# Altium schematic sheet Sheet1.SchDoc
size 431 x 279 mm; SheetNumber: 1; SheetTotal: 1; ENG_APP_DATE: --/--/--; DSN_APP_DATE: --/--/--; CHK_APP_DATE: --/--/--
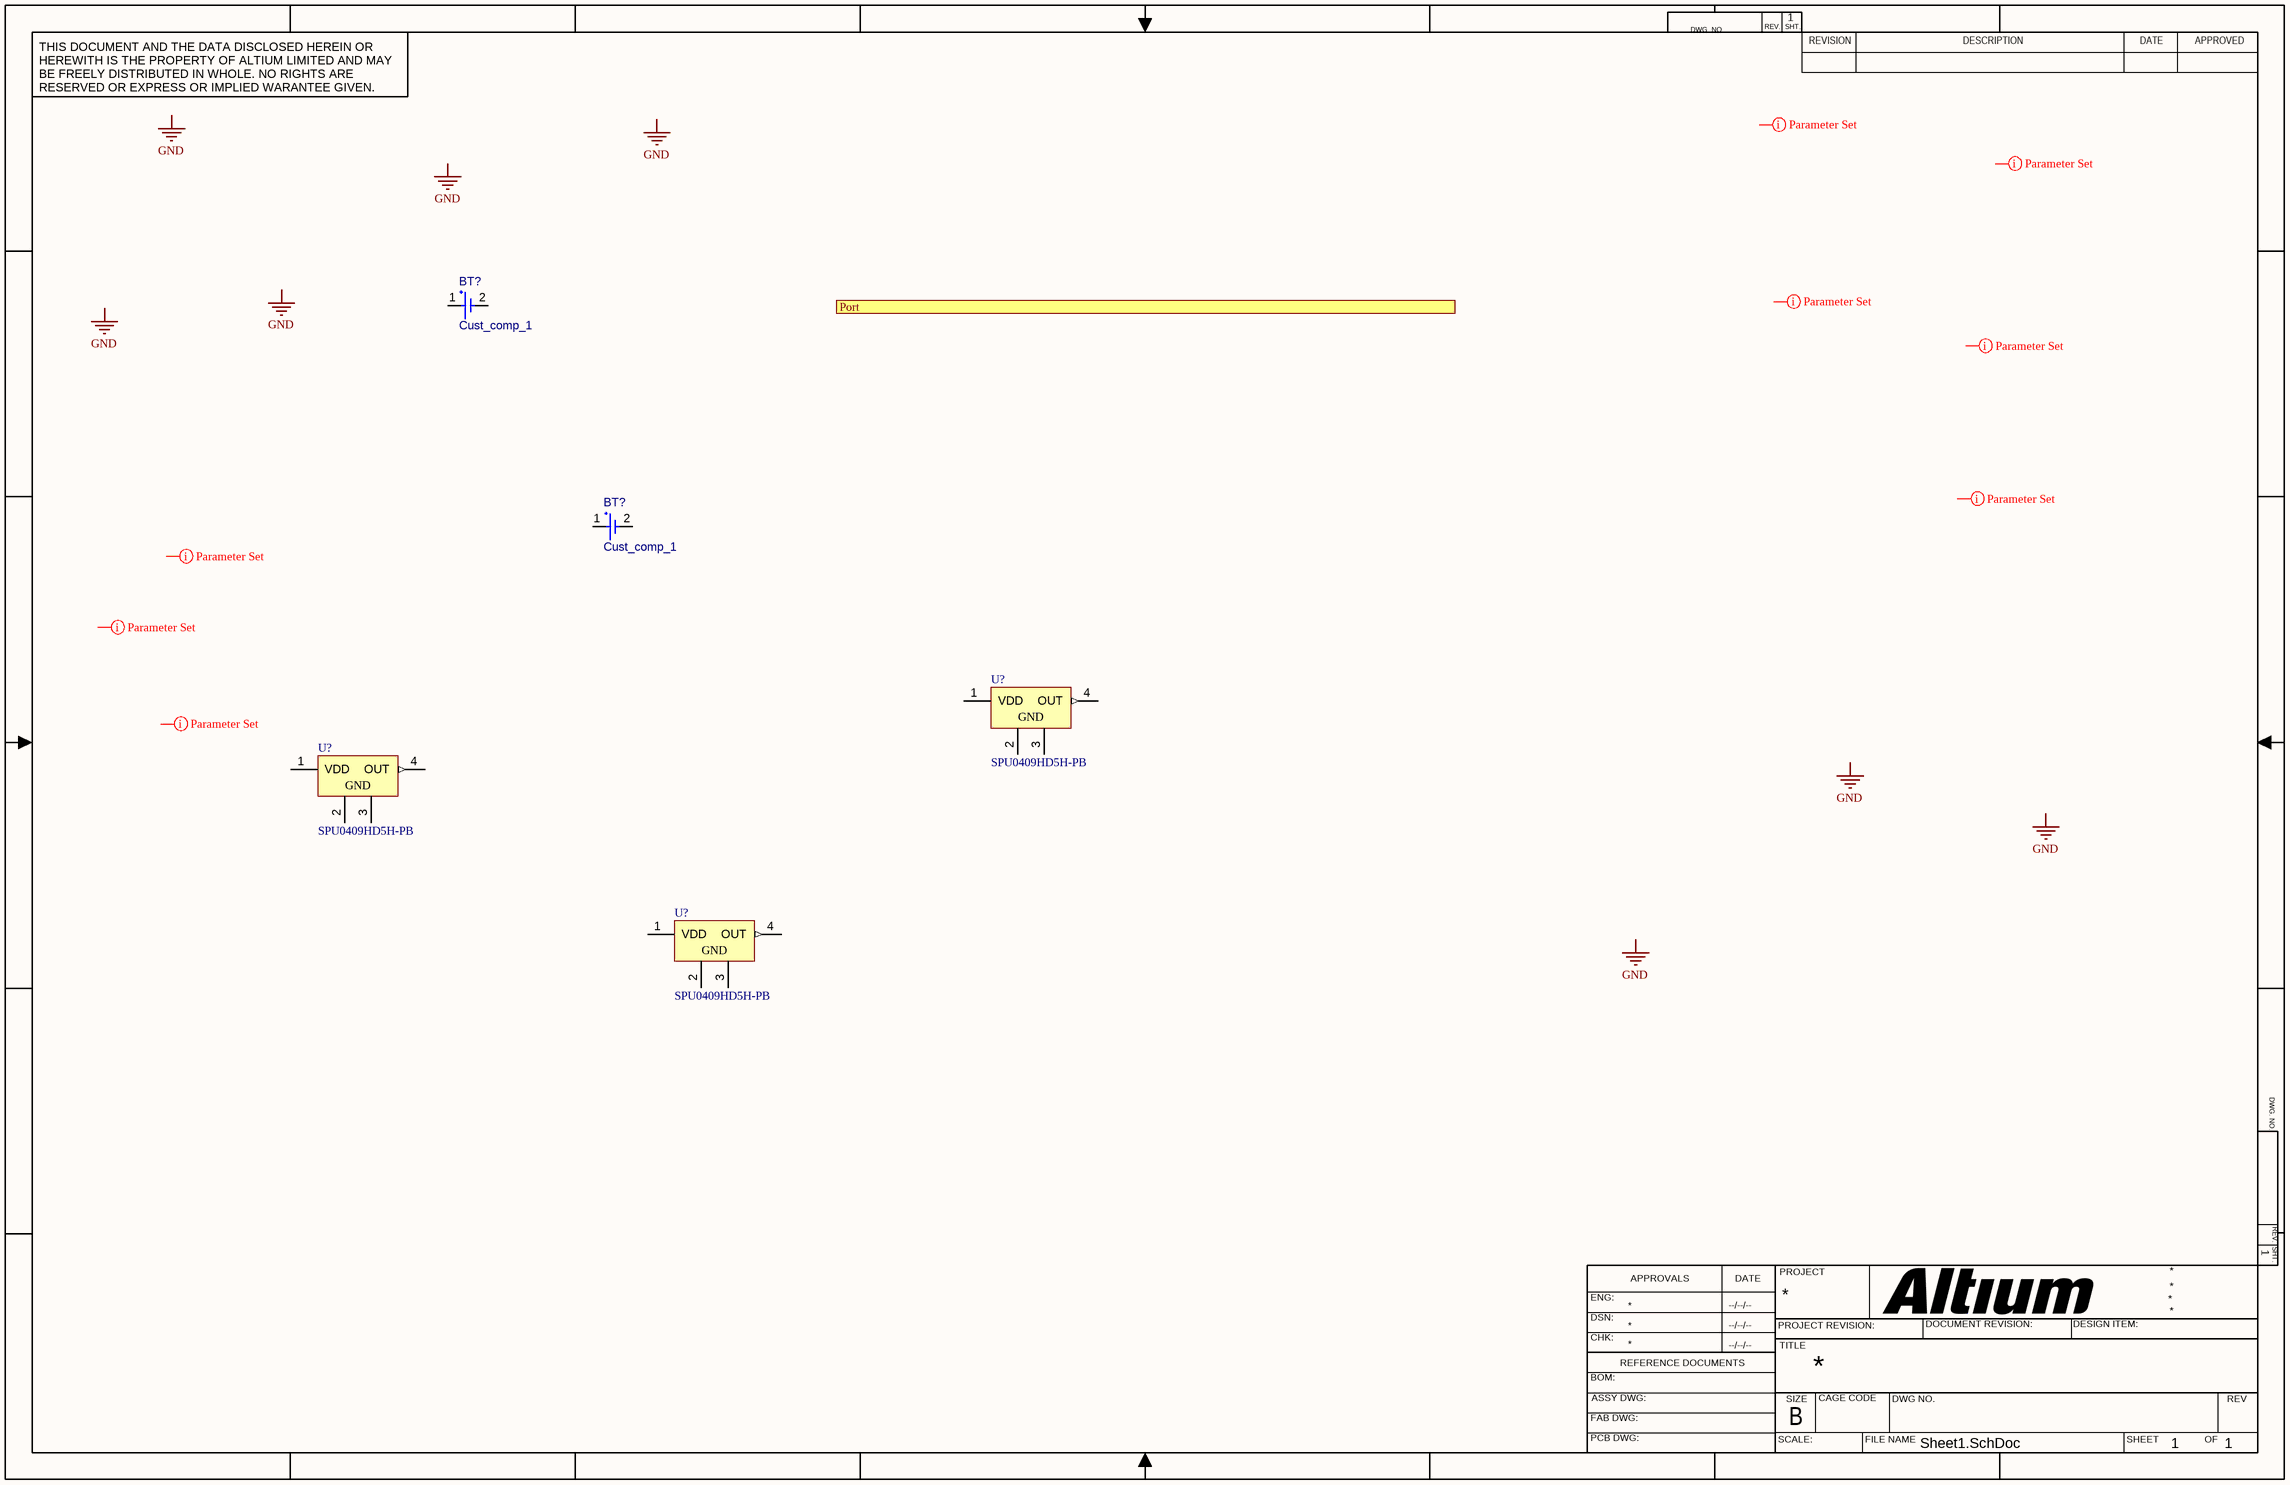
[diagram p0: Sheet1.SchDoc]

## Parts
(Parts that share a designator on the sheet are numbered #1, #2 ... from top to bottom, then left to right.)
BT?#1  Cust_comp_1  [LTST-C190KFKT_V]
BT?#2  Cust_comp_1  [LTST-C190KFKT_V]
U?#1  SPU0409HD5H-PB  [KNOW-SPU0409HD5H-PB_V]
U?#2  SPU0409HD5H-PB  [KNOW-SPU0409HD5H-PB_V]
U?#3  SPU0409HD5H-PB  [KNOW-SPU0409HD5H-PB_V]

## Ports
Port

## Nets

Not connected (* = marked no-connect by the designer): BT?#1 1(+) 2(-); BT?#2 1(+) 2(-); U?#1 1(VDD) 2(GROUND) 3(GROUND) 4(OUT); U?#2 1(VDD) 2(GROUND) 3(GROUND) 4(OUT); U?#3 1(VDD) 2(GROUND) 3(GROUND) 4(OUT)

## Notes on the sheet
- Labels drawn without touching a wire or pin: GND
- DWG. NO.
- REV.
- SHT.
- THIS DOCUMENT AND THE DATA DISCLOSED HEREIN OR HEREWITH IS THE PROPERTY OF ALTIUM LIMITED AND MAY BE FREELY DISTRIBUTED IN WHOLE. NO RIGHTS ARE RESERVED OR EXPRESS OR IMPLIED WARANTEE GIVEN.
- REVISION
- DESCRIPTION
- DATE
- APPROVED
- ENG:
- APPROVALS
- PROJECT
- DSN:
- CHK:
- REFERENCE DOCUMENTS
- PROJECT REVISION:
- TITLE
- DOCUMENT REVISION:
- DESIGN ITEM:
- BOM:
- FAB DWG:
- PCB DWG:
- ASSY DWG:
- SCALE:
- SIZE
- B
- CAGE CODE
- FILE NAME
- DWG NO.
- SHEET
- OF
- REV
- (in symbol CMP-00027-00001-3) GND

## Library data of the parts
BT?#1 BT?#2 = CMP-00027-00004-1: some desc; Parameter: 1V; Parameter 1: 45A; Max Operating Temperature: 150°C; Min Operating Temperature: 10°C; Pins: 2; Case/Package: ssd; Mounting Technology: qwe
U?#1-U?#3 = CMP-00027-00001-3: SiSonic(TM) Microphone, 1.5 to 3.6 V, -40 to 100 degC, 4-Pin SMD, RoHS, Tape and Reel; Manufacturer: Knowles Acoustics; Voltage Rating: 3.6V; Impedance: 100Ohm; Packaging: TapeandReel; Case/Package: SPU0409HD5H-PB; Package Description: 4-Pin Surface Mount Device, Body 3.76 x 2.95 mm; Package Reference: SPU0409HD5H-PB; Package Quantity: 1200; Datasheet URL: http://datasheet.octopart.com/SPU0409HD5H-PB-Knowles-Acoustics-datasheet-17019172.pdf; Datasheet Version: Rev. F, 03/2013; Mounting Technology: SM; Max Operating Temperature: 150°C; RoHS Compliant: True; Min Operating Temperature: 11°C; Manufacturer URL: http://www.knowles.com/